# Altium schematic sheet GSB-S03-CarMicro.SchDoc
size A4
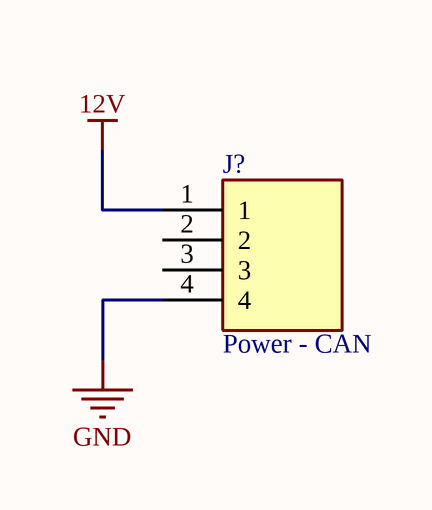
[diagram p0: GSB-S03-CarMicro.SchDoc]

## Parts
J?  Power - CAN  [MOLEX_0436500400]

## Nets
12V: J?.1
GND: J?.4

Not connected (* = marked no-connect by the designer): J? 2 3

## Library data of the parts
J? = 0436500400: Micro-fit 3.0 Connector, 4 Circuit Single Row, Right Angle Throughhole PCB, Snap-In Peg; MF: Molex; MP: 0436500400; SnapEDA_Link: https://www.snapeda.com/parts/0436500400/Molex/view-part/1776823/?ref=snap; Price: None; Package: None; Availability: Unavailable; Value: *; ComponentLink1Description: Snapeda; ComponentLink1URL: https://www.snapeda.com/parts/0436500400/Molex/view-part/1776823/?ref=eda